# EAGLE design smartplug (EAGLE 6.6.0)
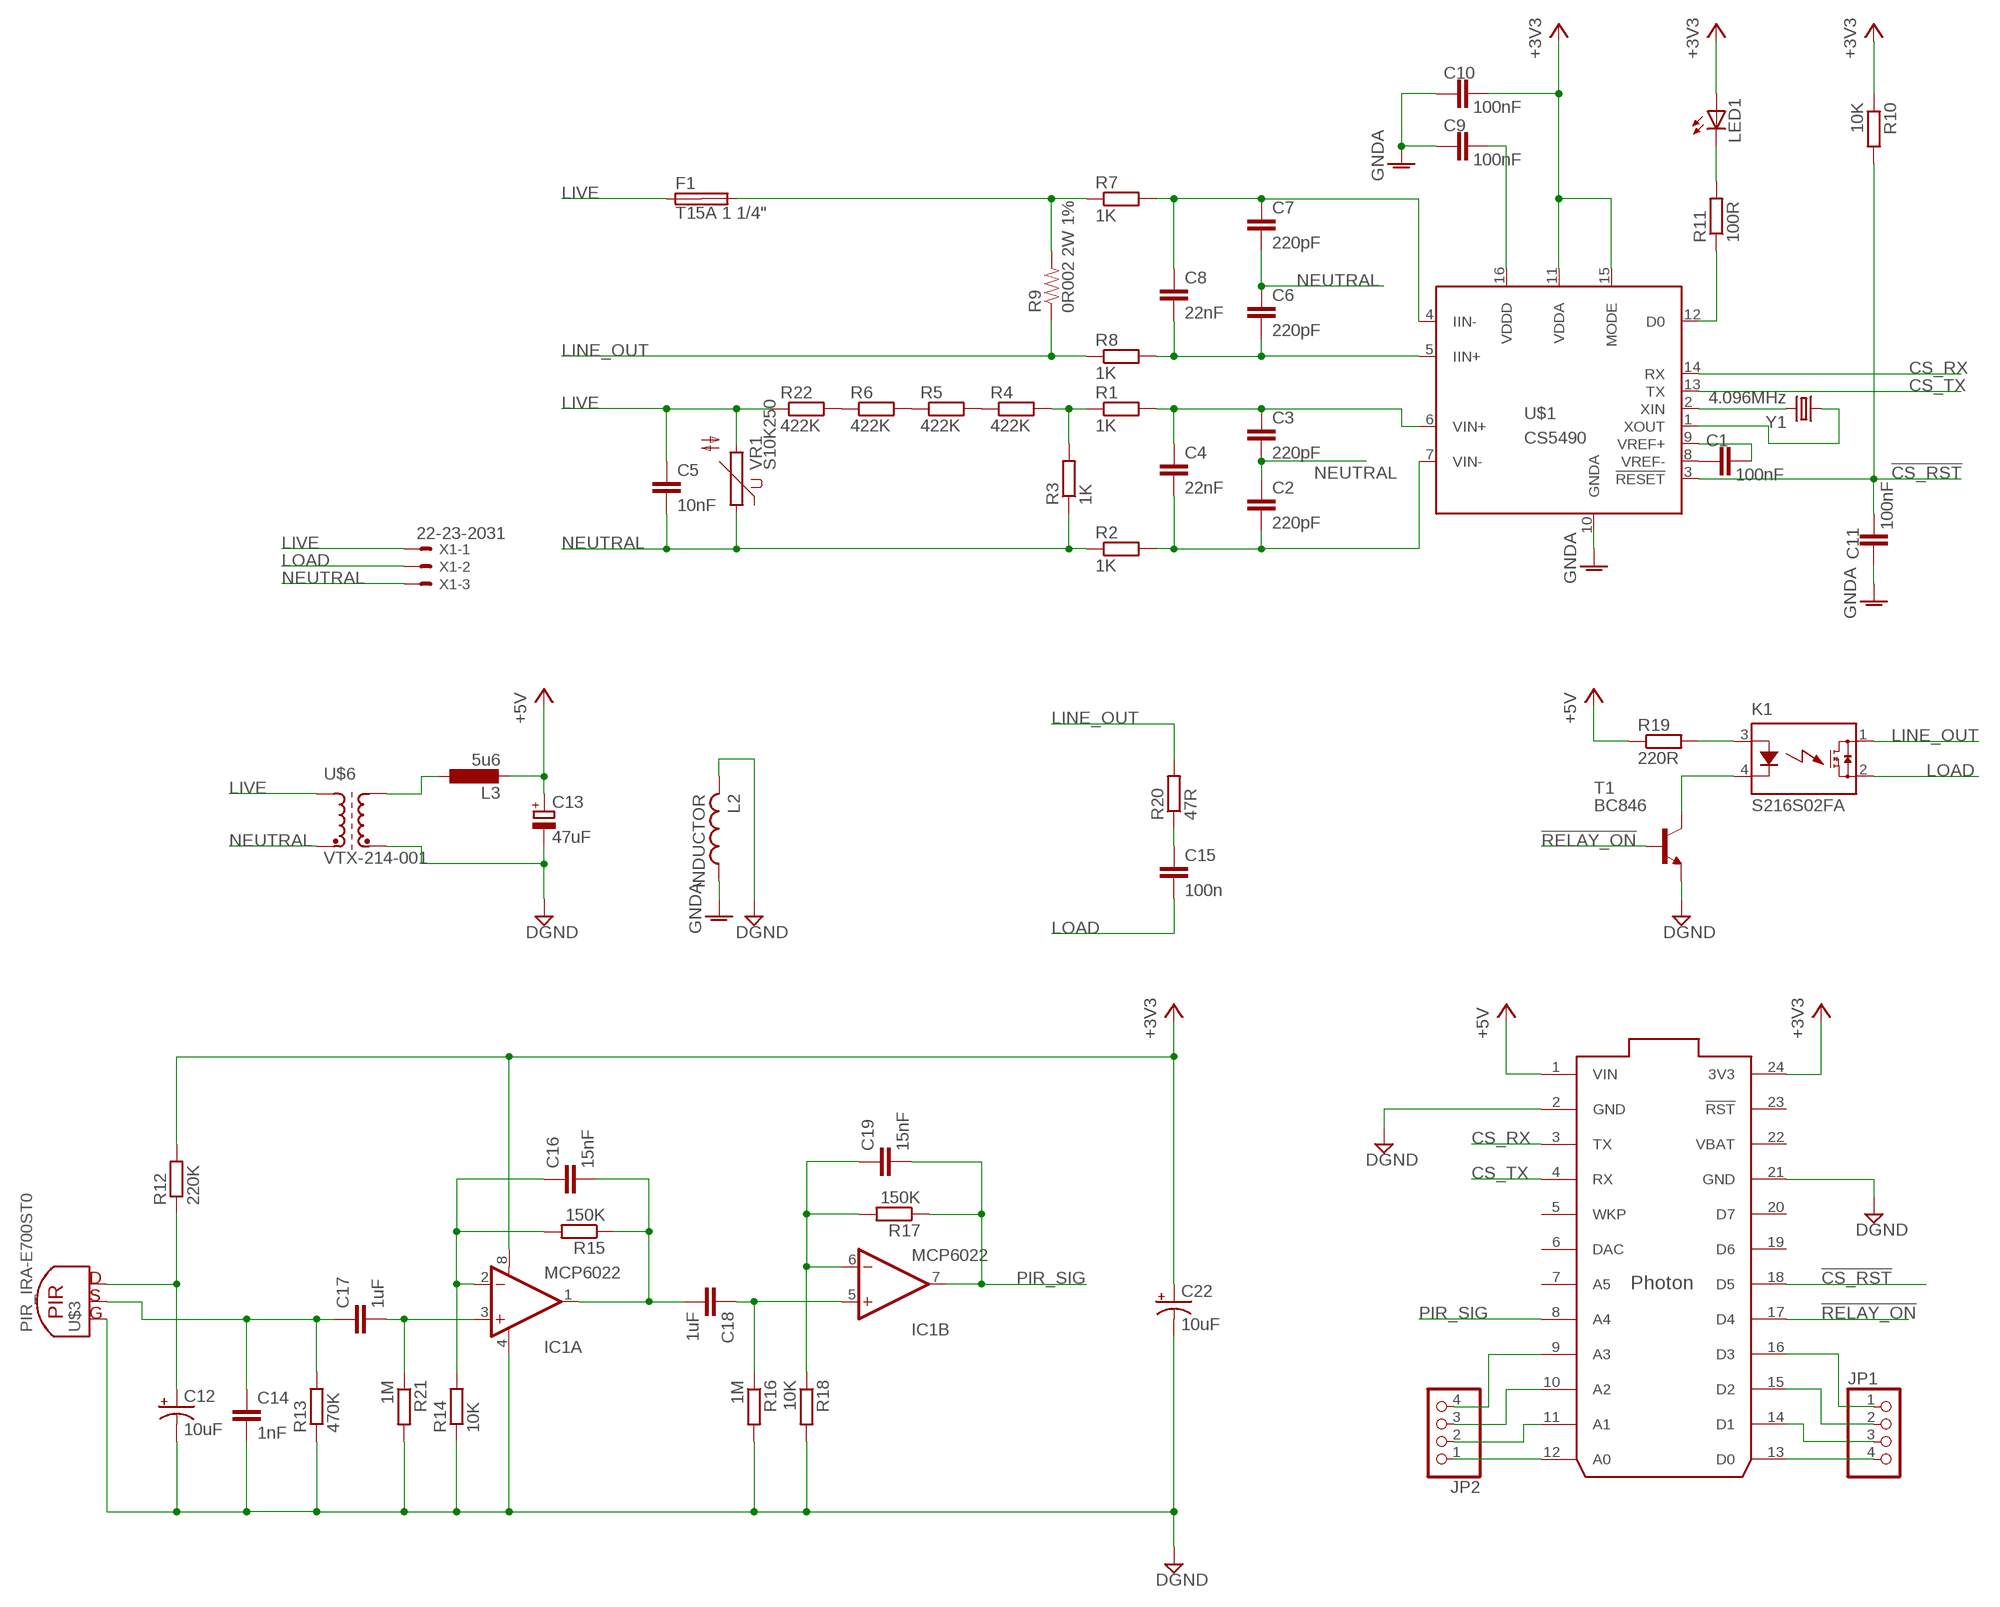
[diagram p0: schematic, sheet 1]

## Parts
C1  100nF  CAP0603-CAP  [0603-CAP]
C2  220pF  CAP0603-CAP  [0603-CAP]
C3  220pF  CAP0603-CAP  [0603-CAP]
C4  22nF  CAP0603-CAP  [0603-CAP]
C5  10nF  CAP0603-CAP  [0603-CAP]
C6  220pF  CAP0603-CAP  [0603-CAP]
C7  220pF  CAP0603-CAP  [0603-CAP]
C8  22nF  CAP0603-CAP  [0603-CAP]
C9  100nF  CAP0603-CAP  [0603-CAP]
C10  100nF  CAP0603-CAP  [0603-CAP]
C11  100nF  CAP0603-CAP  [0603-CAP]
C12  10uF  CAP_POL1206  [EIA3216]
C13  47uF  CPOL-EU153CLV-0505  [153CLV-0505]
C14  1nF  CAP0603-CAP  [0603-CAP]
C15  100n  C-EU150-054X183  [C150-054X183]
C16  15nF  CAP0603-CAP  [0603-CAP]
C17  1uF  CAP0603-CAP  [0603-CAP]
C18  1uF  CAP0603-CAP  [0603-CAP]
C19  15nF  CAP0603-CAP  [0603-CAP]
C22  10uF  CAP_POL1206  [EIA3216]
F1  T15A 1 1/4"  SH32  [SH32]
IC1  MCP6022  OPAMP-DUALU  [SO08]
JP1  PINHD-1X4  [1X04]
JP2  PINHD-1X4  [1X04]
K1  S216S02FA  [S216S02F]
L2  INDUCTOR  [0603]
L3  5u6  ELLCTP  [ELLCTP]
LED1  LEDCHIPLED_1206  [CHIPLED_1206]
R1  1K  R-EU_0603  [0603]
R2  1K  R-EU_0603  [0603]
R3  1K  R-EU_0603  [0603]
R4  422K  R-EU_0603  [0603]
R5  422K  R-EU_0603  [0603]
R6  422K  R-EU_0603  [0603]
R7  1K  R-EU_0603  [0603]
R8  1K  R-EU_0603  [0603]
R9  0R002 2W 1%  RESISTOR2512  [R2512]
R10  10K  R-EU_0603  [0603]
R11  100R  R-EU_0603  [0603]
R12  220K  R-EU_0603  [0603]
R13  470K  R-EU_0603  [0603]
R14  10K  R-EU_0603  [0603]
R15  150K  R-EU_0603  [0603]
R16  1M  R-EU_0603  [0603]
R17  150K  R-EU_0603  [0603]
R18  10K  R-EU_0603  [0603]
R19  220R  R-EU_0603  [0603]
R20  47R  R-EU_0617/5V  [0617V]
R21  1M  R-EU_0603  [0603]
R22  422K  R-EU_0603  [0603]
T1  BC846  [SOT23]
U$1  CS5490  [SOIC16N]
U$2  PHOTON_WITH_HEADERS  [PHOTON]
U$3  PIR_IRA-E700ST0  [PIR_IRA-E700ST0]
U$6  VTX-214-001  [VTX-214-001]
VR1  S10K250  [S10K250]
X1  22-23-2031  [22-23-2031]
Y1  4.096MHz  CRYSTAL10.5X4.8  [CRYSTAL-SMD-10.5X4.8-2PIN]

## Nets
!CS_RST: C11.2 R10.2 U$1.3(!RESET) U$2.18(D5)
!RELAY_ON: T1.1(B) U$2.17(D4)
+3V3: C10.2 C22.A(+) IC1.8(A:V+) LED1.A R10.1 R12.2 U$1.11(VDDA) U$1.15(MODE) U$2.24(3V3)
+5V: C13.+ L3.2 R19.1 U$2.1(VIN)
CS_RX: U$1.14(RX) U$2.3(TX)
CS_TX: U$1.13(TX) U$2.4(RX)
DGND: C12.C(-) C13.- C14.2 C22.C(-) IC1.4(A:V-) L2.2 R13.1 R14.1 R16.2 R18.2 R21.2 T1.2(E) U$2.2(GND) U$2.21(GND) U$3.GND U$6.P$V-(E2)
GNDA: C9.1 C10.1 C11.1 L2.1 U$1.10(GNDA)
LINE_OUT: K1.1(DS1) R8.1 R9.1 R20.2
LIVE: C5.1 F1.1A R22.1 U$6.P$L(A1) VR1.2 X1.1
LOAD: C15.2 K1.2(DS2) X1.2
N$1: U$1.2(XIN) Y1.P$2
N$2: U$1.1(XOUT) Y1.P$1
N$3: C1.1 U$1.8(VREF-)
N$4: C1.2 U$1.9(VREF+)
N$5: C9.2 U$1.16(VDDD)
N$6: C12.A(+) R12.1 U$3.DRAIN+(DRAIN)
N$7: C2.2 C4.2 R2.2 U$1.7(VIN-)
N$8: C3.1 C4.1 R1.2 U$1.6(VIN+)
N$9: C6.2 C8.2 R8.2 U$1.5(IIN+)
N$10: C7.1 C8.1 R7.2 U$1.4(IIN-)
N$11: R1.1 R3.2 R4.2
N$12: C14.1 C17.1 R13.2 U$3.SOURCE
N$13: R4.1 R5.2
N$14: R5.1 R6.2
N$15: C16.1 IC1.2(A:-IN) R14.2 R15.2
N$16: R11.1 U$1.12(D0)
N$17: K1.4(K) T1.3(C)
N$18: C17.2 IC1.3(A:+IN) R21.1
N$19: LED1.C R11.2
N$20: C18.1 IC1.5(B:+IN) R16.1
N$21: L3.1 U$6.P$V+(A2)
N$22: K1.3(A) R19.2
N$23: C15.1 R20.1
N$24: C19.1 IC1.6(B:-IN) R17.2 R18.1
N$25: C16.2 C18.2 IC1.1(A:OUT) R15.1
N$26: F1.2A R7.1 R9.2
N$27: JP2.1 U$2.12(A0)
N$28: JP2.2 U$2.11(A1)
N$29: JP2.3 U$2.10(A2)
N$30: JP2.4 U$2.9(A3)
N$31: JP1.4 U$2.13(D0)
N$32: JP1.3 U$2.14(D1)
N$33: JP1.2 U$2.15(D2)
N$34: JP1.1 U$2.16(D3)
N$35: R6.1 R22.2
NEUTRAL: C2.1 C3.2 C5.2 C6.1 C7.2 R2.1 R3.1 U$6.P$N(E1) VR1.1 X1.3
PIR_SIG: C19.2 IC1.7(B:OUT) R17.1 U$2.8(A4)
Unconnected: F1.1B F1.2B U$2.5(WKP) U$2.6(DAC) U$2.7(A5) U$2.19(D6) U$2.20(D7) U$2.23(!RST)

## Power pins joined to a net without a drawn wire
VBAT: U$2.22(VBAT)

## Library data of the parts
C1-C11 = SparkFun:CAP: Capacitor Standard 0603 ceramic capacitor, and 0.1" leaded capacitor.
C12 C22 = SparkFun:CAP_POL: Capacitor Polarized These are standard SMD and PTH capacitors. Normally 10uF, 47uF, and 100uF in electrolytic and tantalum varieties. Always verify the external diameter of the through hole cap, it varies with capacity, voltage, and manufacturer. The EIA devices should be standard.
C13 = rcl:CPOL-EU: POLARIZED CAPACITOR, European symbol
C14 C16-C19 = smartplug:CAP: Capacitor Standard 0603 ceramic capacitor, and 0.1" leaded capacitor.
C15 = rcl:C-EU: CAPACITOR, European symbol
F1 = smartplug:SH32: FUSE HOLDER 6 x 32 mm, SH contact, SHH3N Schukat, 102071 Wickmann (Buerklin); FARNELL_OC: 811786; MPN: 10207101009; OC_NEWARK: 76R6904
IC1 = smartplug:OPAMP-DUAL: Operational Amplifier
JP1 JP2 = pinhead:PINHD-1X4: PIN HEADER
K1 = smartplug:S216S02F: SSR; FARNELL_OC: 1618480; MANUF_PART#: S216S02F; MOUSER_OC: 852-S216S02F
L2 = Rebel:INDUCTOR
L3 = eva:ELLCTP
LED1 = led:LED: LED OSRAM: - CHIPLED LG R971, LG N971, LY N971, LG Q971, LY Q971, LO R971, LY R971 LH N974, LH R974 LS Q976, LO Q976, LY Q976 LO Q996 - Hyper CHIPLED LW Q18S LB Q993, LB Q99A, LB R99A - SideLED LS A670, LO A670, LY A670, LG A670, LP A670 LB A673, LV A673, LT A673, LW A673 LH A674 LY A675 LS A676, LA A676, LO A676, LY A676, LW A676 LS A679, LY A679, LG A679 - Hyper Micro SIDELED® LS Y876, LA Y876, LO Y876, LY Y876 LT Y87S - SmartLED LW L88C, LW L88S LB L89C, LB L89S, LG L890 LS L89K, LO L89K, LY L89K LS L896, LA L896, LO L896, LY L896 - TOPLED LS T670, LO T670, LY T670, LG T670, LP T670 LSG T670, LSP T670, LSY T670, LOP T670, LYG T670 LG T671, LOG T671, LSG T671 LB T673, LV T673, LT T673, LW T673 LH T674 LS T676, LA T676, LO T676, LY T676, LB T676, LH T676, LSB T676, LW T676 LB T67C, LV T67C, LT T67C, LS T67K, LO T67K, LY T67K, LW E67C LS E67B, LA E67B, LO E67B, LY E67B, LB E67C, LV E67C, LT E67C LW T67C LS T679, LY T679, LG T679 LS T770, LO T770, LY T770, LG T770, LP T770 LB T773, LV T773, LT T773, LW T773 LH T774 LS E675, LA E675, LY E675, LS T675 LS T776, LA T776, LO T776, LY T776, LB T776 LHGB T686 LT T68C, LB T68C - Hyper Mini TOPLED® LB M676 - Mini TOPLED Santana® LG M470 LS M47K, LO M47K, LY M47K Source: http://www.osram.convergy.de LUXEON: - LUMILED® LXK2-PW12-R00, LXK2-PW12-S00, LXK2-PW14-U00, LXK2-PW14-V00 LXK2-PM12-R00, LXK2-PM12-S00, LXK2-PM14-U00 LXK2-PE12-Q00, LXK2-PE12-R00, LXK2-PE12-S00, LXK2-PE14-T00, LXK2-PE14-U00 LXK2-PB12-K00, LXK2-PB12-L00, LXK2-PB12-M00, LXK2-PB14-N00, LXK2-PB14-P00, LXK2-PB14-Q00 LXK2-PR12-L00, LXK2-PR12-M00, LXK2-PR14-Q00, LXK2-PR14-R00 LXK2-PD12-Q00, LXK2-PD12-R00, LXK2-PD12-S00 LXK2-PH12-R00, LXK2-PH12-S00 LXK2-PL12-P00, LXK2-PL12-Q00, LXK2-PL12-R00 Source: www.luxeon.com KINGBRIGHT: KA-3528ASYC Source: www.kingbright.com
R1-R8 R10-R19 R21 R22 = Rebel:R-EU_: RESISTOR, European symbol
R9 = SparkFun:RESISTOR: Resistor Basic schematic elements and footprints for 0603, 1206, and PTH resistors.; FARNELL_OC: 2321760; MANUF_PART#: CRF2512-FV-R002ELF
R20 = resistor:R-EU_: RESISTOR, European symbol
T1 = transistor-neu-to92:BC846: NPN TRANSISTOR
U$1 = smartplug:CS5490; MANUF_PART#: CS5490-ISZR; MOUSER_OC: 777-CS5490-ISZR
U$2 = smartplug:PHOTON
U$3 = smartplug:PIR_IRA-E700ST0: PIR - RE200
U$6 = Rebel:VTX-214-001
VR1 = varistor:S10K250: VARISTOR; FARNELL_OC: 1004355; MANUF_PART#: B72210S0251K101
X1 = con-molex:22-23-2031: .100" (2.54mm) Center Header - 3 Pin; MF: MOLEX; MPN: 22-23-2031; OC_FARNELL: 1462950; OC_NEWARK: 30C0862
Y1 = SparkFun:CRYSTAL: Crystals Various standard crystals. Proven footprints. Spark Fun Electronics SKU : COM-00534; FARNELL_OC: 2467740; MANUF_PART#: ABLS2-4.096MHZ-D4Y-T

## Board
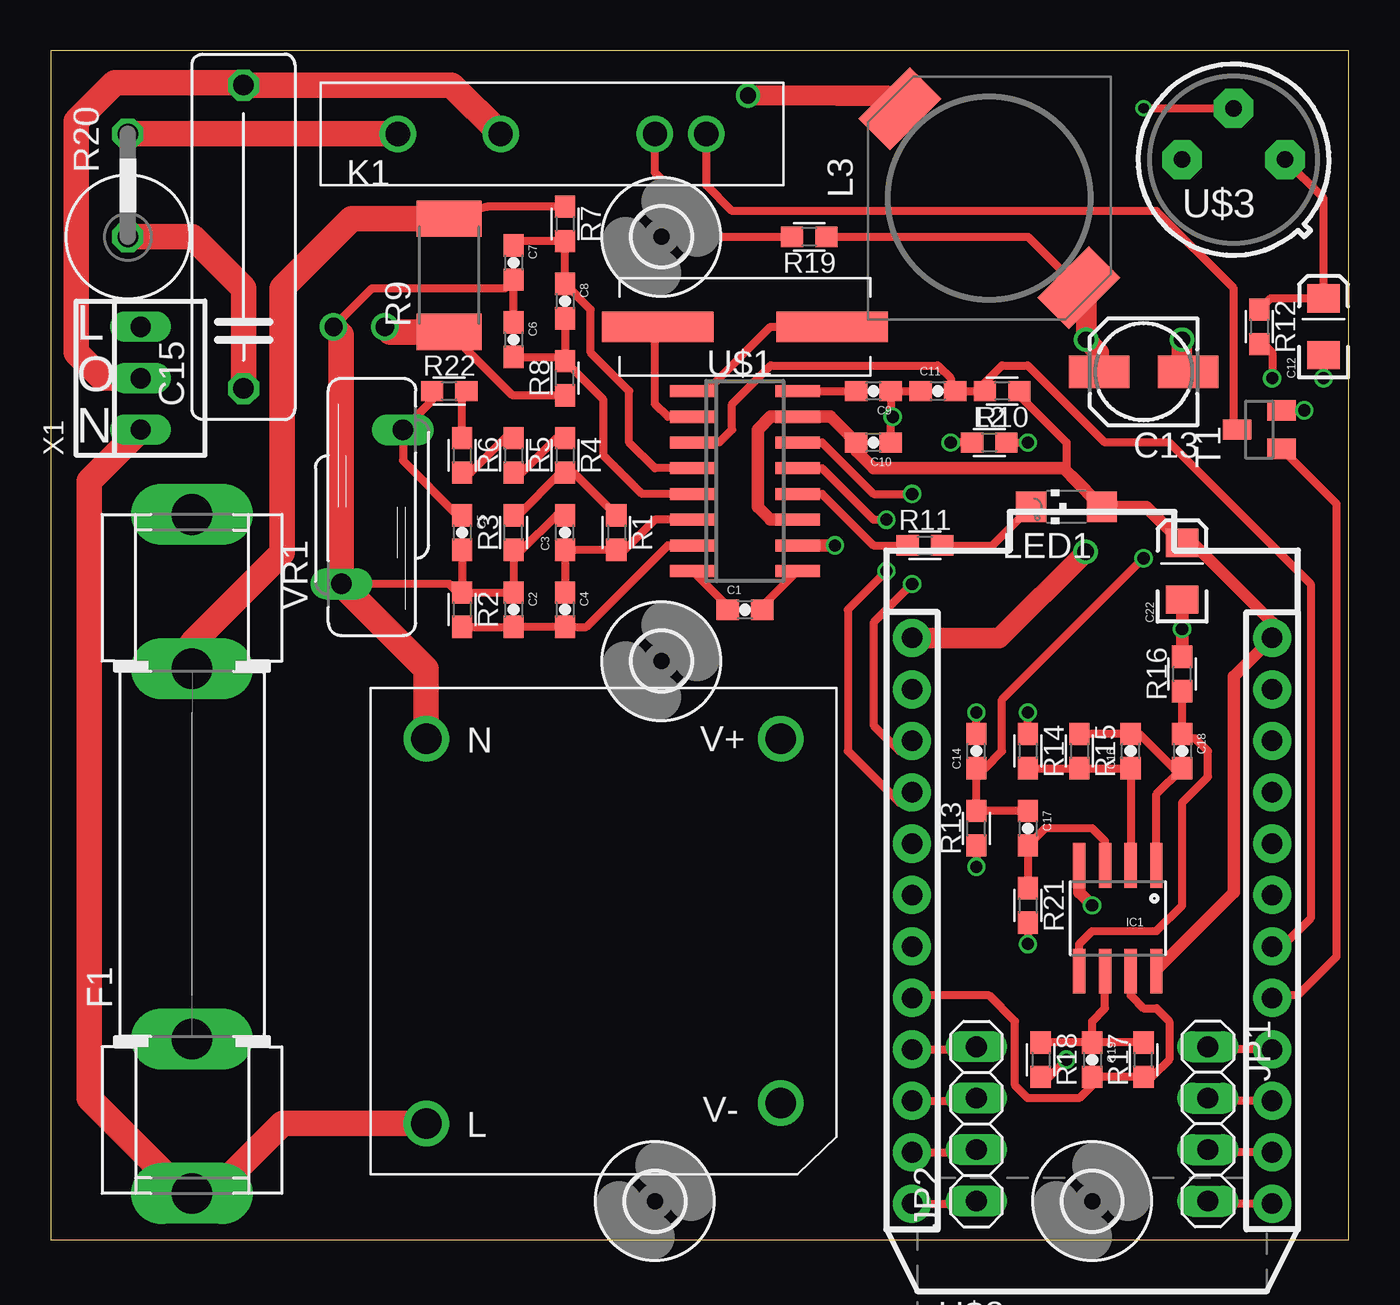
[diagram p1: board, top side]
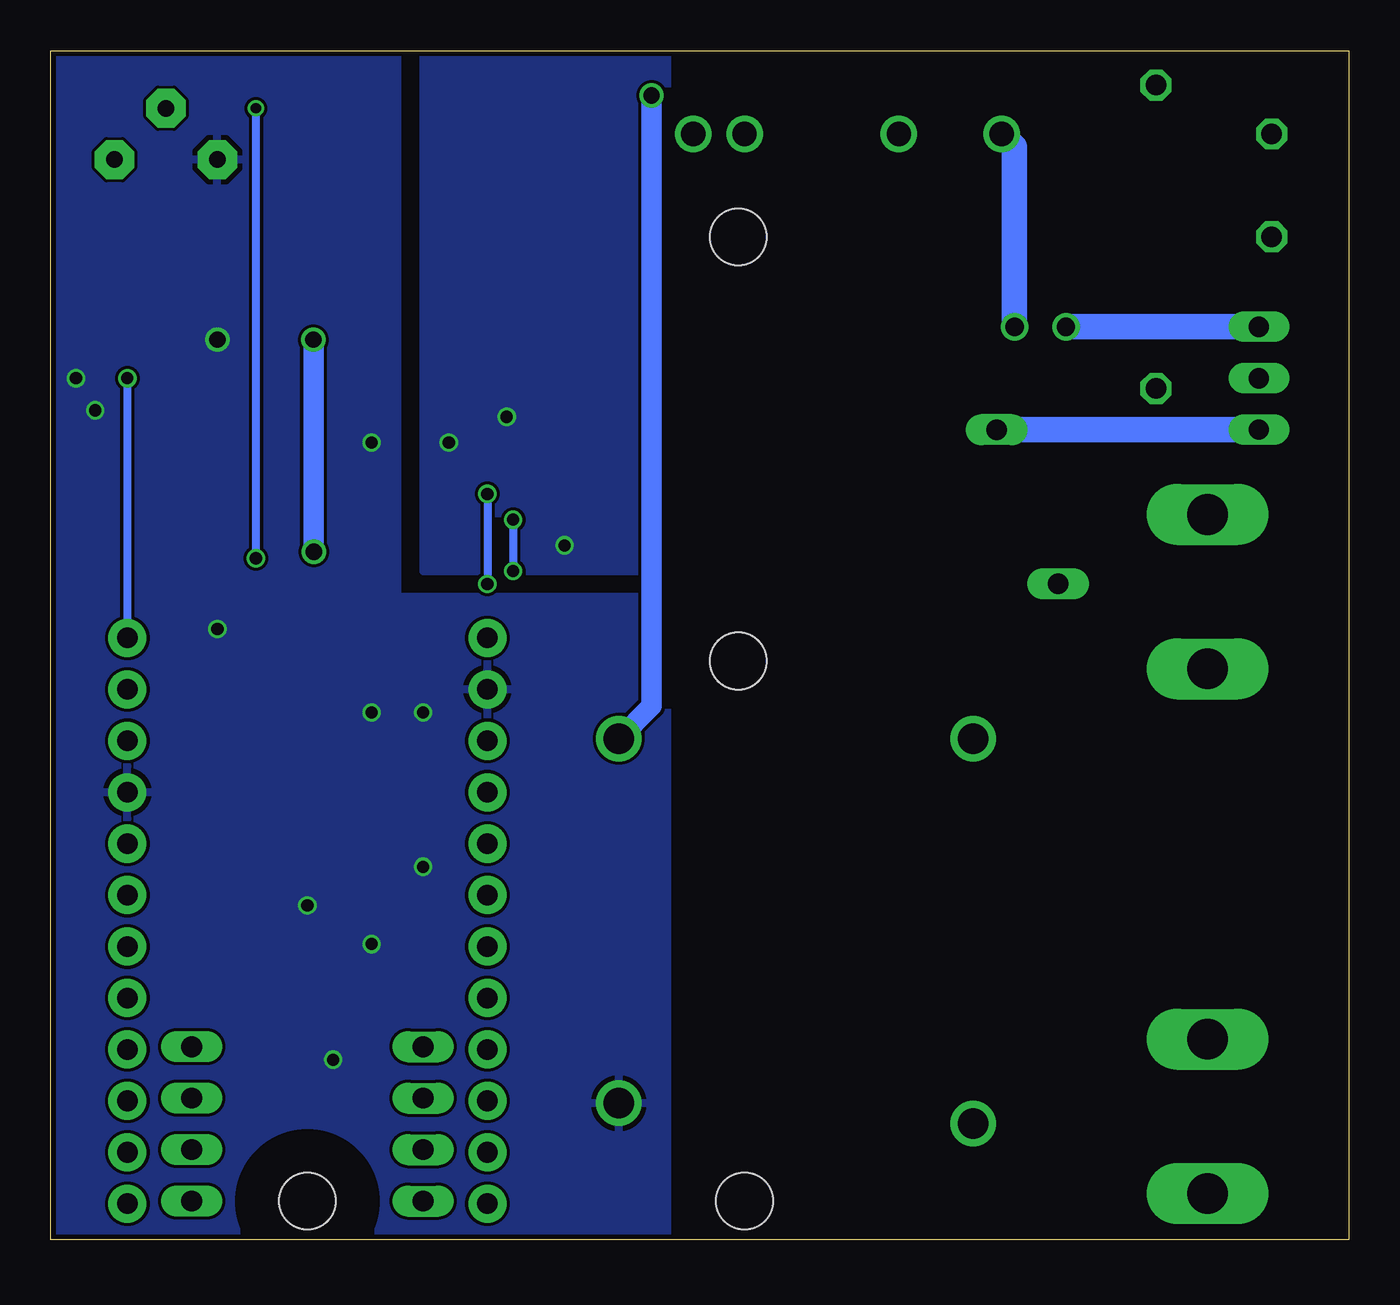
[diagram p2: board, bottom side, seen from below]

Size 64.11 x 58.72 mm. Coordinates in mm from the lower left corner, seen from the top.
Outline: 0,0 64.11,0 64.11,58.72 0,58.72 0,0
Copper layers (1*16): Top 0.035mm / dielectric 1.5mm / Bottom 0.035mm
Design rules "Fusion_eagle_rule_v1.1": minimum track width 6mil, minimum drill 12mil, track to track 6mil, track to pad 6mil, pad to pad 6mil, via to via 6mil, smd to smd 0mil, copper to edge 10mil, drill to drill 10mil, minimum pad ring 10mil, minimum via ring 6mil, stop-mask expansion 2mil, vias tented up to drill 100mil, thermal gap 10mil

### Footprints (pad centres in the part's own frame; a part is rotated, then mirrored left to right if it is on the bottom)
0603-CAP = smd 1.1 x 1: 1 -0.85,0; 2 0.85,0
EIA3216 = smd 1.4 x 1.6: A 1.4,0; C -1.4,0
153CLV-0505 = smd 3 x 1.6: + 2.2,0; - -2.2,0
C150-054X183 = drill 1.016 octagon: 1 -7.493,0; 2 7.493,0
SH32 = drill 2.007 long: 1A -16.764,0; 1B -9.144,0; 2A 9.144,0; 2B 16.764,0
SO08 = smd 0.61 x 2.21: 1 -1.905,-2.616; 2 -0.635,-2.616; 3 0.635,-2.616; 4 1.905,-2.616; 5 1.905,2.616; 6 0.635,2.616; 7 -0.635,2.616; 8 -1.905,2.616
1X04 = drill 1.016 long: 1 -3.81,0; 2 -1.27,0; 3 1.27,0; 4 3.81,0
S216S02F = drill 1.2: 1 -8.89,0; 2 -3.81,0; 3 3.81,0; 4 6.35,0
0603 = smd 1.1 x 1: 1 -0.85,0; 2 0.85,0
ELLCTP = smd 3.6 x 2.2 rotated 315: 1 -4.428,-4.421; 2 4.411,4.418
CHIPLED_1206 = smd 1.5 x 1.5: A 0,-1.75; C 0,1.75
R2512 = smd 1.8 x 3.2: 1 -2.8,0; 2 2.8,0
0617V = drill 1.016 octagon: 1 -2.54,0; 2 2.54,0
SOT23 = smd 1 x 1.4: 1 -0.95,-1.1; 2 0.95,-1.1; 3 0,1.1
SOIC16N = smd 0.6 x 2.2: 1 -4.445,-2.6; 2 -3.175,-2.6; 3 -1.905,-2.6; 4 -0.635,-2.6; 5 0.635,-2.6; 6 1.905,-2.6; 7 3.175,-2.6; 8 4.445,-2.6; 9 4.445,2.6; 10 3.175,2.6; 11 1.905,2.6; 12 0.635,2.6; 13 -0.635,2.6; 14 -1.905,2.6; 15 -3.175,2.6; 16 -4.445,2.6
PHOTON = drill 1.016 pad 1.88: 1 1.27,32.258; 2 1.27,29.718; 3 1.27,27.178; 4 1.27,24.638; 5 1.27,22.098; 6 1.27,19.558; 7 1.27,17.018; 8 1.27,14.478; 9 1.27,11.938; 10 1.27,9.398; 11 1.27,6.858; 12 1.27,4.318; 13 19.05,4.318; 14 19.05,6.858; 15 19.05,9.398; 16 19.05,11.938; 17 19.05,14.478; 18 19.05,17.018; 19 19.05,19.558; 20 19.05,22.098; 21 19.05,24.638; 22 19.05,27.178; 23 19.05,29.718; 24 19.05,32.258
PIR_IRA-E700ST0 = drill 0.813 pad 1.93 octagon: DRAIN+ 2.54,0; GND -2.54,0; SOURCE 0,2.54
2,8 = hole 2.8: 0,0
VTX-214-001 = drill 1.5: P$L -8.75,-9.5; P$N -8.75,9.5; P$V+ 8.75,9.5; P$V- 8.75,-8.5
S10K250 = drill 1.016 long: 1 -1.524,-3.81; 2 1.524,3.81
22-23-2031 = drill 1 long: 1 -2.54,0; 2 0,0; 3 2.54,0
CRYSTAL-SMD-10.5X4.8-2PIN = smd 5.5 x 1.5: P$1 -4.3,0; P$2 4.3,0

### Placement (x,y rotation side)
C1  34.29,31.11 0 top
C2  22.86,31.11 270 top
C3  25.4,34.92 90 top
C4  25.4,31.11 270 top
C5  20.32,34.92 270 top
C6  22.86,44.45 270 top
C7  22.86,48.26 270 top
C8  25.4,46.35 270 top
C9  40.64,41.91 180 top
C10  40.64,39.37 180 top
C11  43.81,41.91 0 top
C12  62.87,45.09 90 top
C13  53.98,42.86 180 top
C14  45.72,24.13 90 top
C15  9.53,49.53 90 top
C16  53.34,24.13 90 top
C17  48.26,20.32 270 top
C18  55.88,24.13 270 top
C19  51.44,8.89 270 top
C22  55.88,33.02 90 top
F1  6.99,19.05 90 top
IC1  52.7,15.87 180 top
JP1  57.15,5.71 270 top
JP2  45.72,5.71 90 top
K1  26.04,54.61 0 top
L2  46.35,39.37 0 top
L3  46.35,51.43 270 top
LED1  50.16,36.2 90 top
R1  27.94,34.92 270 top
R2  20.32,31.11 270 top
R3  22.86,34.92 90 top
R4  25.4,38.73 270 top
R5  22.86,38.73 270 top
R6  20.32,38.73 270 top
R7  25.4,50.16 270 top
R8  25.4,42.54 90 top
R9  19.68,47.62 90 top
R10  46.99,41.91 180 top
R11  43.18,34.29 0 top
R12  59.69,45.09 270 top
R13  45.72,20.32 90 top
R14  48.26,24.13 270 top
R15  50.8,24.13 270 top
R16  55.88,27.94 90 top
R17  53.98,8.89 90 top
R18  48.9,8.89 270 top
R19  37.47,49.53 180 top
R20  3.81,52.07 90 top
R21  48.26,16.51 270 top
R22  19.68,41.91 0 top
T1  59.69,40 90 top
U$1  34.29,37.46 270 top
U$2  41.27,-2.54 0 top
U$3  58.42,53.34 0 top
U$4  [2,8]  29.84,1.9 0 top
U$5  [2,8]  30.16,49.53 0 top
U$6  27.3,15.24 0 top
U$7  [2,8]  30.16,28.57 0 top
U$8  [2,8]  51.44,1.9 0 top
VR1  15.88,36.2 0 top
X1  4.45,42.54 90 top
Y1  34.29,45.09 180 top

### Tracks (layer width: path | path; a pad name or v marks a point on that pad's centre or on a via)
!CS_RST
  Top 0.406: 44.45,41.7 C11.2 | C11.2 44.45,42.12 44.45,42.54 43.81,43.18 35.56,43.18 33.66,41.27 33.66,40 33.02,39.37 U$1.3 | C11.2 R10.2 | C11.2 45.72,41.91 46.99,43.18 48.26,43.18 52.07,39.37 55.24,39.37 62.23,32.38 62.23,15.87 60.96,14.6 60.45,14.6 U$2.18
!RELAY_ON
  Top 0.406: T1.1 63.5,36.34 63.5,13.97 61.59,12.06 60.45,12.06 U$2.17
+3V3  (via drill 0.6)
  Top 0.406: R12.2 59.91,44.23 60.33,43.81 v60.33,42.54 | R10.1 47.84,41.7 50.16,39.37 50.16,37.95 50.41,37.7
  Top 0.61: U$1.11 35.56,35.56 34.92,36.2 34.92,40 35.56,40.64 U$1.15 38.52,40.64 C10.2 39.79,38.95 40.64,38.1 50.01,38.1 50.41,37.7 LED1.A 54.1,36.2 C22.A 56.38,34.42 60.33,30.48 U$2.24 58.42,27.81 58.42,17.14 54.61,13.33 IC1.8
  Bottom 0.406: v60.33,42.54 U$2.24
+5V  (via drill 0.8)
  Top 0.406: R19.1 48.27,49.53 L3.2
  Top 1.016: U$2.1 46.86,29.72 v51.12,33.97 | L3.2 51.14,46.66 v51.14,44.45 51.77,43.81 C13.+
  Bottom 1.016: v51.12,33.97 51.12,44.43 v51.14,44.45
CS_RX  (via drill 0.6)
  Top 0.406: U$1.14 38.1,39.37 40.64,36.83 v42.55,36.83 | v42.55,32.38 40.64,30.48 40.64,25.4 41.91,24.13 42.42,24.13 U$2.3
  Bottom 0.406: v42.55,36.83 v42.55,32.38
CS_TX  (via drill 0.6)
  Top 0.406: U$1.13 38.1,38.1 40.64,35.56 v41.27,35.56 | v41.27,33.02 39.37,31.11 39.37,24.13 41.91,21.59 42.42,21.59 U$2.4
  Bottom 0.406: v41.27,35.56 v41.27,33.02
DGND  (via drill 0.6, 0.8)
  Top 0.406: R14.1 v48.26,26.04 | R13.1 v45.72,18.42 | R21.2 v48.26,14.6 | L2.2 v48.26,39.37 | C12.C v62.87,42.54 | T1.2 v61.91,40.95 v61.91,40.96 | C14.2 v45.72,26.04 | R18.2 49.31,8.04 v50.16,8.89
  Top 0.61: IC1.4 50.8,17.14 v51.44,16.51 | C22.C v55.88,30.16 R16.2
  Top 1.016: C13.- 55.86,43.16 55.86,44.43 v55.88,44.45
  pour Bottom: 46.99,59.05 73.03,59.05 73.03,-0.64 33.66,-0.64 33.66,31.75 46.99,31.75
GNDA  (via drill 0.6)
  Top 0.406: C11.1 C9.1 41.49,40.74 v41.59,40.64 41.49,40.54 C10.1 | L2.1 v44.45,39.37
  Top 0.61: U$1.10 v38.73,34.29
  pour Bottom: 45.72,59.05 45.72,33.02 33.66,33.02 33.66,59.05
LINE_OUT  (via drill 0.9)
  Top 0.406: R8.1 22.82,41.7 R9.1
  Top 1.27: R9.1 16.77,44.82 v16.51,45.09 | R20.2 K1.1
  Bottom 1.27: v16.51,45.09 16.51,53.97 K1.1
LIVE
  Top 0.406: R22.1 18.84,41.44 VR1.2 17.4,38.48 20.11,35.77 C5.1
  Top 1.27: X1.1 1.91,37.46 1.91,6.98 6.6,2.29 F1.1A 8,2.29 11.46,5.74 U$6.P$L
  Bottom 1.27: X1.1 VR1.2
LOAD
  Top 1.27: X1.2 2.54,42.54 1.27,43.81 1.27,55.24 3.17,57.15 9.4,57.15 C15.2 19.81,57.02 K1.2
N$1
  Top 0.406: U$1.2 30.48,40.64 29.84,41.27 29.84,44.94 Y1.P$2
N$2
  Top 0.406: U$1.1 32.38,41.91 35.56,45.09 Y1.P$1
N$3
  Top 0.406: C1.1 33.44,31.27 U$1.8
N$4
  Top 0.406: C1.2 35.14,31.27 U$1.9
N$5
  Top 0.406: U$1.16 C9.2
N$6
  Top 0.406: U$3.DRAIN+ 62.87,51.43 C12.A 60.24,46.48 R12.1
N$7
  Top 0.406: R2.2 C2.2 C4.2 26.45,30.27 30.48,34.29 U$1.7
N$8
  Top 0.406: U$1.6 29.84,35.56 28.36,34.07 R1.2 C3.1 C4.1
N$9
  Top 0.406: U$1.5 29.21,36.83 27.3,38.73 27.3,41.49 R8.2 | C6.2 25.2,43.6 R8.2 | C8.2 R8.2
N$10
  Top 0.406: U$1.4 29.84,38.1 28.57,39.37 28.57,41.91 26.67,43.81 26.67,45.93 C8.1 R7.2 23.07,49.31 C7.1
N$11
  Top 0.406: R3.2 23.07,35.77 25.18,37.88 R4.2 25.83,37.88 R1.1
N$12  (via drill 0.5, 0.6)
  Top 0.406: C17.1 R13.2 C14.1 46.14,23.28 46.99,24.13 46.99,26.67 v53.98,33.66 | v53.98,55.88 U$3.SOURCE
  Bottom 0.406: v53.98,33.66 v53.98,55.88
N$13
  Top 0.406: R5.2 23.28,37.88 24.98,39.59 R4.1
N$14
  Top 0.406: R6.2 20.74,37.88 22.44,39.59 R5.1
N$15
  Top 0.406: IC1.2 C16.1 R15.2 R14.2
N$16
  Top 0.406: U$1.12 38.1,36.83 40.64,34.29 R11.1
N$17
  Top 0.406: T1.3 58.42,40 58.42,46.99 54.61,50.8 33.66,50.8 32.38,52.07 K1.4
N$18
  Top 0.406: R21.1 C17.2 49.11,20.32 51.44,20.32 52.07,19.69 IC1.3
N$19
  Top 0.406: R11.2 46.51,34.29 LED1.C
N$20
  Top 0.406: R16.1 C18.1 56.09,24.77 56.52,24.77 57.15,24.13 57.15,22.86 55.88,21.59 55.88,16.51 54.61,15.24 51.44,15.24 50.8,14.6 IC1.5
N$21  (via drill 0.8)
  Top 1.016: v34.44,56.52 38.87,56.5 41.3,56.5 L3.1
  Bottom 1.016: v34.44,56.52 34.44,26.36 U$6.P$V+
N$22
  Top 0.406: R19.2 33.02,49.53 29.84,52.7 K1.3
N$23
  Top 1.27: R20.1 6.99,49.53 9.53,46.99 C15.1
N$24
  Top 0.406: IC1.6 52.07,11.43 51.44,10.79 C19.1 | C19.1 R18.1 | R17.2 C19.1
N$25
  Top 0.406: IC1.1 54.61,22.01 C18.2 55.46,23.28 53.76,24.98 C16.2 R15.1
N$26
  Top 0.406: R7.1 21.55,51.02 R9.2
  Top 1.27: R9.2 14.87,50.42 11.43,46.99 11.43,33.91 6.99,29.46 F1.2A
N$27
  Top 0.406: U$2.12 45.59,1.78 JP2.1
N$28
  Top 0.406: U$2.11 45.59,4.32 JP2.2
N$29
  Top 0.406: U$2.10 45.59,6.86 JP2.3
N$30
  Top 0.406: U$2.9 45.59,9.4 JP2.4
N$31
  Top 0.406: U$2.13 57.28,1.78 JP1.4
N$32
  Top 0.406: U$2.14 57.28,4.32 JP1.3
N$33
  Top 0.406: U$2.15 57.28,6.86 JP1.2
N$34
  Top 0.406: U$2.16 57.28,9.4 JP1.1
N$35
  Top 0.406: R6.1 20.32,41.7 R22.2
NEUTRAL  (via drill 0.9)
  Top 0.406: R2.1 C2.1 R3.1 23.28,34.07 24.98,35.77 C3.2 | C5.2 R2.1 | R2.1 20.11,31.96 19.68,32.38 VR1.1 | C6.1 C7.2 22.44,46.99 15.88,46.99 14.35,45.47 14.35,44.7
  Top 1.27: v13.97,45.09 14.35,44.7 VR1.1 18.55,28.18 U$6.P$N
  Bottom 1.27: X1.3 v13.97,45.09
PIR_SIG
  Top 0.406: IC1.7 53.34,12.06 53.98,11.43 54.61,11.43 55.24,10.79 55.24,8.89 54.4,8.04 R17.1 C19.2 51.44,7.62 50.8,6.98 48.26,6.98 47.62,7.62 47.62,10.79 46.35,12.06 42.67,12.06 U$2.8

### Text on the board
tPlace: L | O | N